# EAGLE schematic self-balancing-car (EAGLE 9.6.2)
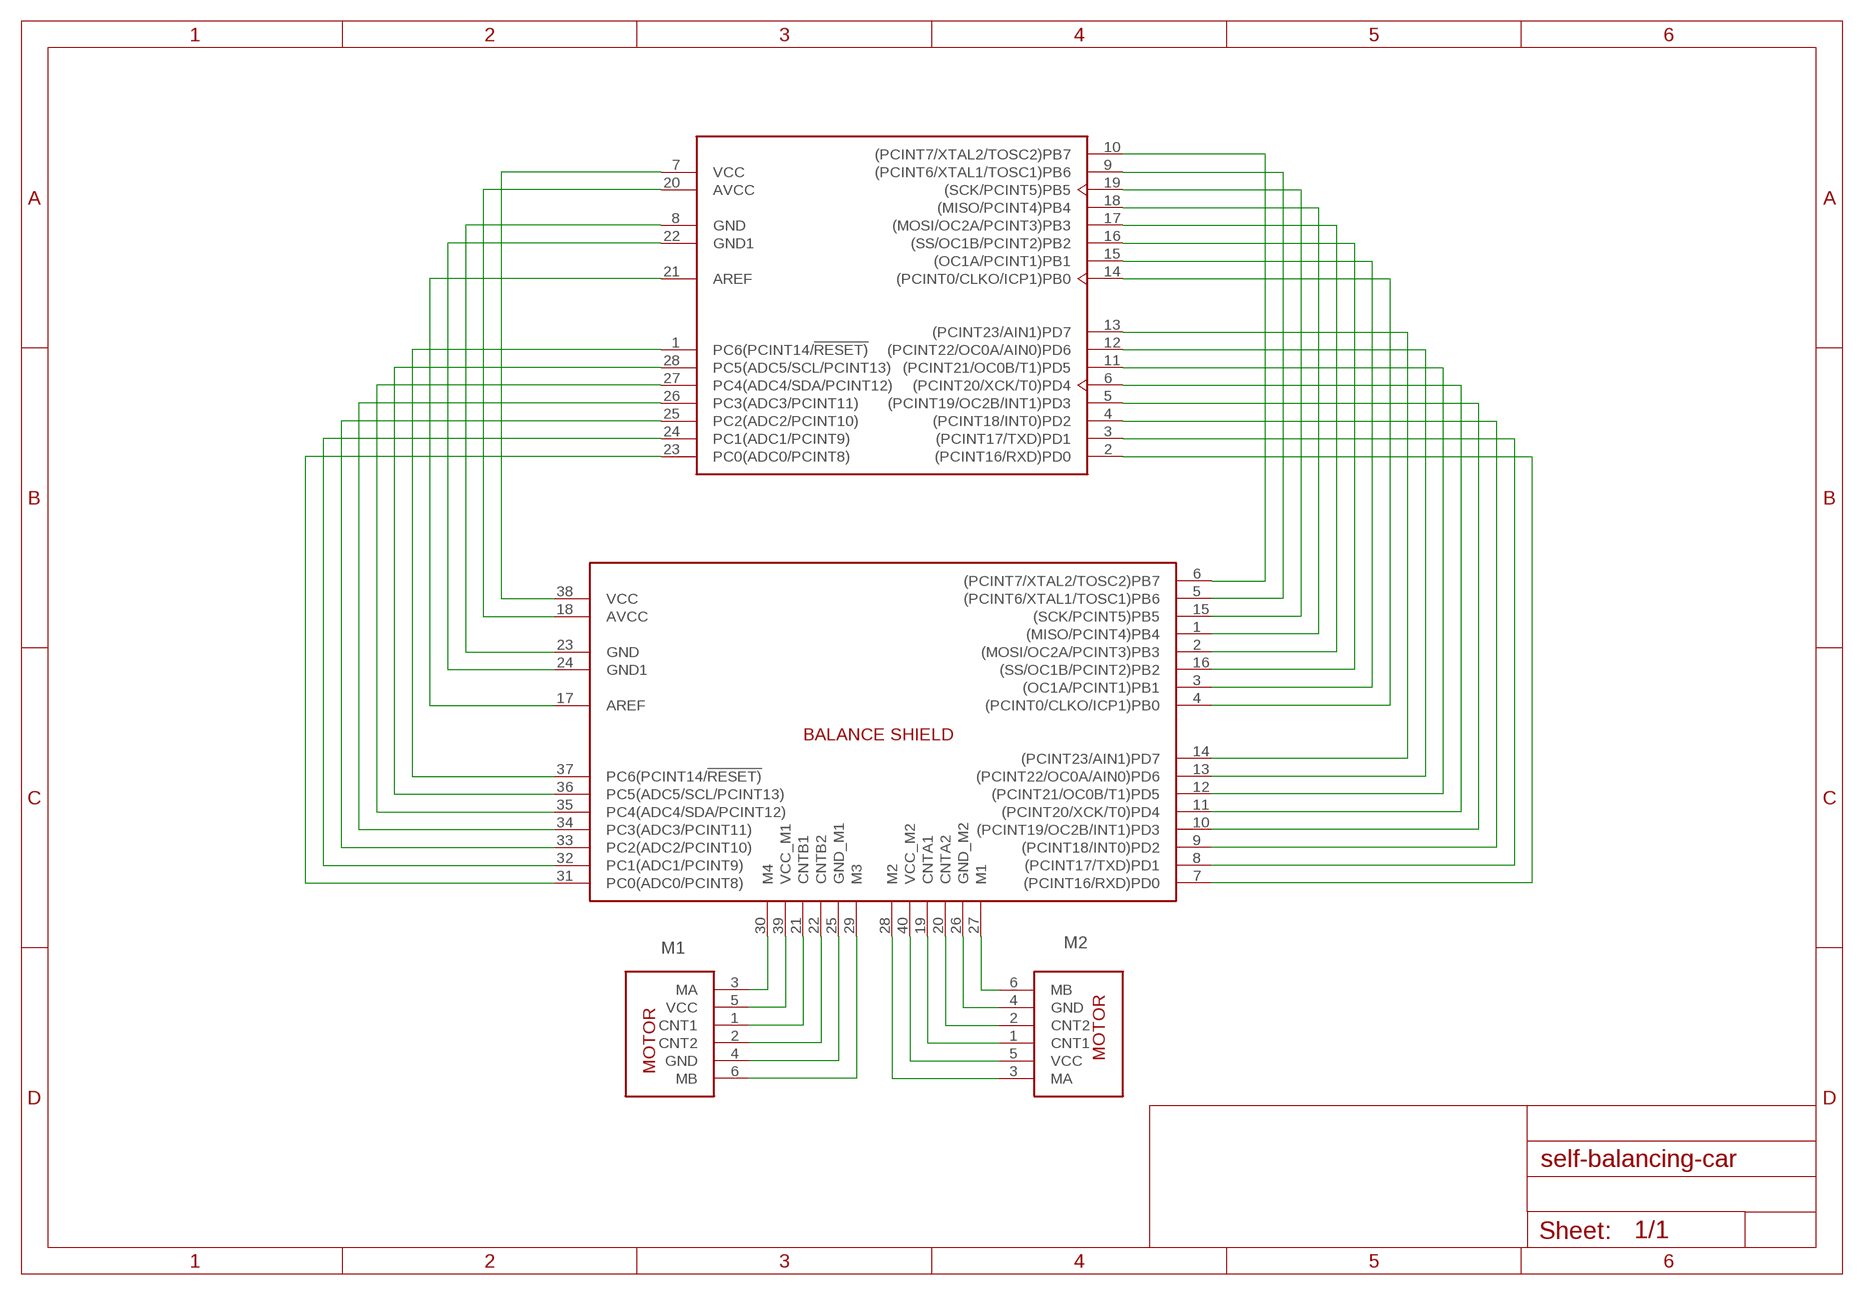
[diagram p0: schematic, sheet 1]

## Parts
M1  MOTOR  [PDIP-8]
M2  MOTOR  [PDIP-8]
U1  ATMEGA328P-PU  [DIP-28]
U$1  BALANCE_SHIELD  [44-TQFP]

## Nets
N$1: U1.7(VCC) U$1.38(VCC)
N$2: U1.20(AVCC) U$1.18(AVCC)
N$3: U1.8(GND) U$1.23(GND)
N$4: U1.22(GND1) U$1.24(GND1)
N$5: U1.21(AREF) U$1.17(AREF)
N$6: U1.1(PC6(PCINT14/!RESET)) U$1.37(PC6(PCINT14/!RESET))
N$7: U1.28(PC5(ADC5/SCL/PCINT13)) U$1.36(PC5(ADC5/SCL/PCINT13))
N$8: U1.27(PC4(ADC4/SDA/PCINT12)) U$1.35(PC4(ADC4/SDA/PCINT12))
N$9: U1.26(PC3(ADC3/PCINT11)) U$1.34(PC3(ADC3/PCINT11))
N$10: U1.25(PC2(ADC2/PCINT10)) U$1.33(PC2(ADC2/PCINT10))
N$11: U1.24(PC1(ADC1/PCINT9)) U$1.32(PC1(ADC1/PCINT9))
N$12: U1.23(PC0(ADC0/PCINT8)) U$1.31(PC0(ADC0/PCINT8))
N$13: U1.10((PCINT7/XTAL2/TOSC2)PB7) U$1.6((PCINT7/XTAL2/TOSC2)PB7)
N$14: U1.9((PCINT6/XTAL1/TOSC1)PB6) U$1.5((PCINT6/XTAL1/TOSC1)PB6)
N$15: U1.19((SCK/PCINT5)PB5) U$1.15((SCK/PCINT5)PB5)
N$16: U1.18((MISO/PCINT4)PB4) U$1.1((MISO/PCINT4)PB4)
N$17: U1.17((MOSI/OC2A/PCINT3)PB3) U$1.2((MOSI/OC2A/PCINT3)PB3)
N$18: U1.16((SS/OC1B/PCINT2)PB2) U$1.16((SS/OC1B/PCINT2)PB2)
N$19: U1.15((OC1A/PCINT1)PB1) U$1.3((OC1A/PCINT1)PB1)
N$20: U1.14((PCINT0/CLKO/ICP1)PB0) U$1.4((PCINT0/CLKO/ICP1)PB0)
N$21: U1.13((PCINT23/AIN1)PD7) U$1.14((PCINT23/AIN1)PD7)
N$22: U1.12((PCINT22/OC0A/AIN0)PD6) U$1.13((PCINT22/OC0A/AIN0)PD6)
N$23: U1.11((PCINT21/OC0B/T1)PD5) U$1.12((PCINT21/OC0B/T1)PD5)
N$24: U1.6((PCINT20/XCK/T0)PD4) U$1.11((PCINT20/XCK/T0)PD4)
N$25: U1.5((PCINT19/OC2B/INT1)PD3) U$1.10((PCINT19/OC2B/INT1)PD3)
N$26: U1.4((PCINT18/INT0)PD2) U$1.9((PCINT18/INT0)PD2)
N$27: U1.3((PCINT17/TXD)PD1) U$1.8((PCINT17/TXD)PD1)
N$28: U1.2((PCINT16/RXD)PD0) U$1.7((PCINT16/RXD)PD0)
N$29: M1.3(MA) U$1.30(M4)
N$30: M1.5(VCC) U$1.39(VCC_M1)
N$31: M1.1(CNT1) U$1.21(CNTB1)
N$32: M1.2(CNT2) U$1.22(CNTB2)
N$33: M1.4(GND) U$1.25(GND_M1)
N$34: M1.6(MB) U$1.29(M3)
N$35: M2.3(MA) U$1.28(M2)
N$36: M2.5(VCC) U$1.40(VCC_M2)
N$37: M2.1(CNT1) U$1.19(CNTA1)
N$38: M2.2(CNT2) U$1.20(CNTA2)
N$39: M2.4(GND) U$1.26(GND_M2)
N$40: M2.6(MB) U$1.27(M1)

## Library data of the parts
M1 M2 = balance-shield:MOTOR
U1 = Microcontroller:ATMEGA328P-PU: IC MCU 8BIT 32KB FLASH 28DIP Manufacturer's datasheet <http://ww1.microchip.com/downloads/en/DeviceDoc/ATmega48A-PA-88A-PA-168A-PA-328-P-DS-DS40002061A.pdf>; CREATED_BY: PCBLayout.com; DIGIKEY_PART_NUMBER: ATMEGA328P-PU-ND; MANUFACTURER: Microchip Technology; MPN: ATMEGA328P-PU; PACKAGE: DIP-28
U$1 = balance-shield:BALANCE_SHIELD

## Module ARDUINO
Ports: 

### Library data of the parts